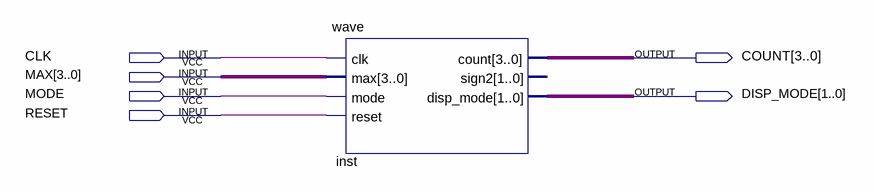
[diagram p0: schematic sheet]
// Quartus schematic wave_down.bdf as structural Verilog: 1 symbols, 6 pins
module wave_down (
  input  CLK,
  input  [3:0] MAX,
  input  MODE,
  input  RESET,
  output [3:0] COUNT,
  output [1:0] DISP_MODE
);

  wave inst (.clk(CLK), .max(MAX), .mode(MODE), .reset(RESET), .count(COUNT), .disp_mode(DISP_MODE));  // open: sign2
endmodule
